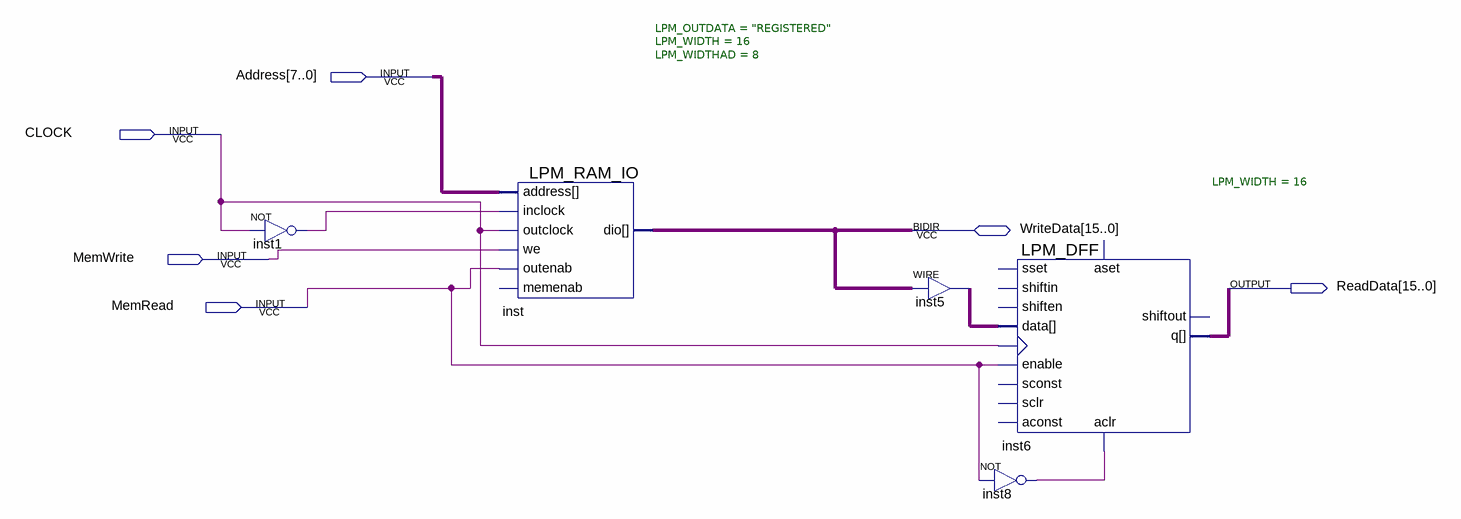
[diagram p0: schematic sheet]
// Quartus schematic DataMemory.bdf as structural Verilog: 5 symbols, 6 pins
module DataMemory (
  input  [7:0] Address,
  input  CLOCK,
  input  MemWrite,
  input  MemRead,
  inout  [15:0] WriteData,
  output [15:0] ReadData
);

  wire inst1_out, inst8_out;
  wire [15:0] inst5_out;

  not inst1 (inst1_out, CLOCK);
  LPM_RAM_IO #(.LPM_OUTDATA("REGISTERED"), .LPM_WIDTH(16), .LPM_WIDTHAD(8)) inst (
    .address(Address), .outclock(CLOCK), .inclock(inst1_out), .we(MemWrite), .outenab(MemRead),
    .dio(WriteData));  // open: memenab
  assign inst5_out = WriteData;  // WIRE inst5
  LPM_DFF #(.LPM_WIDTH(16)) inst6 (
    .enable(MemRead), .clock(CLOCK), .data(inst5_out), .aclr(inst8_out), .q(ReadData));  // open: shiftin, shiften, aconst, sclr, sconst, sset, aset, shiftout
  not inst8 (inst8_out, MemRead);
endmodule
